# EAGLE schematic RX (EAGLE 6.4)
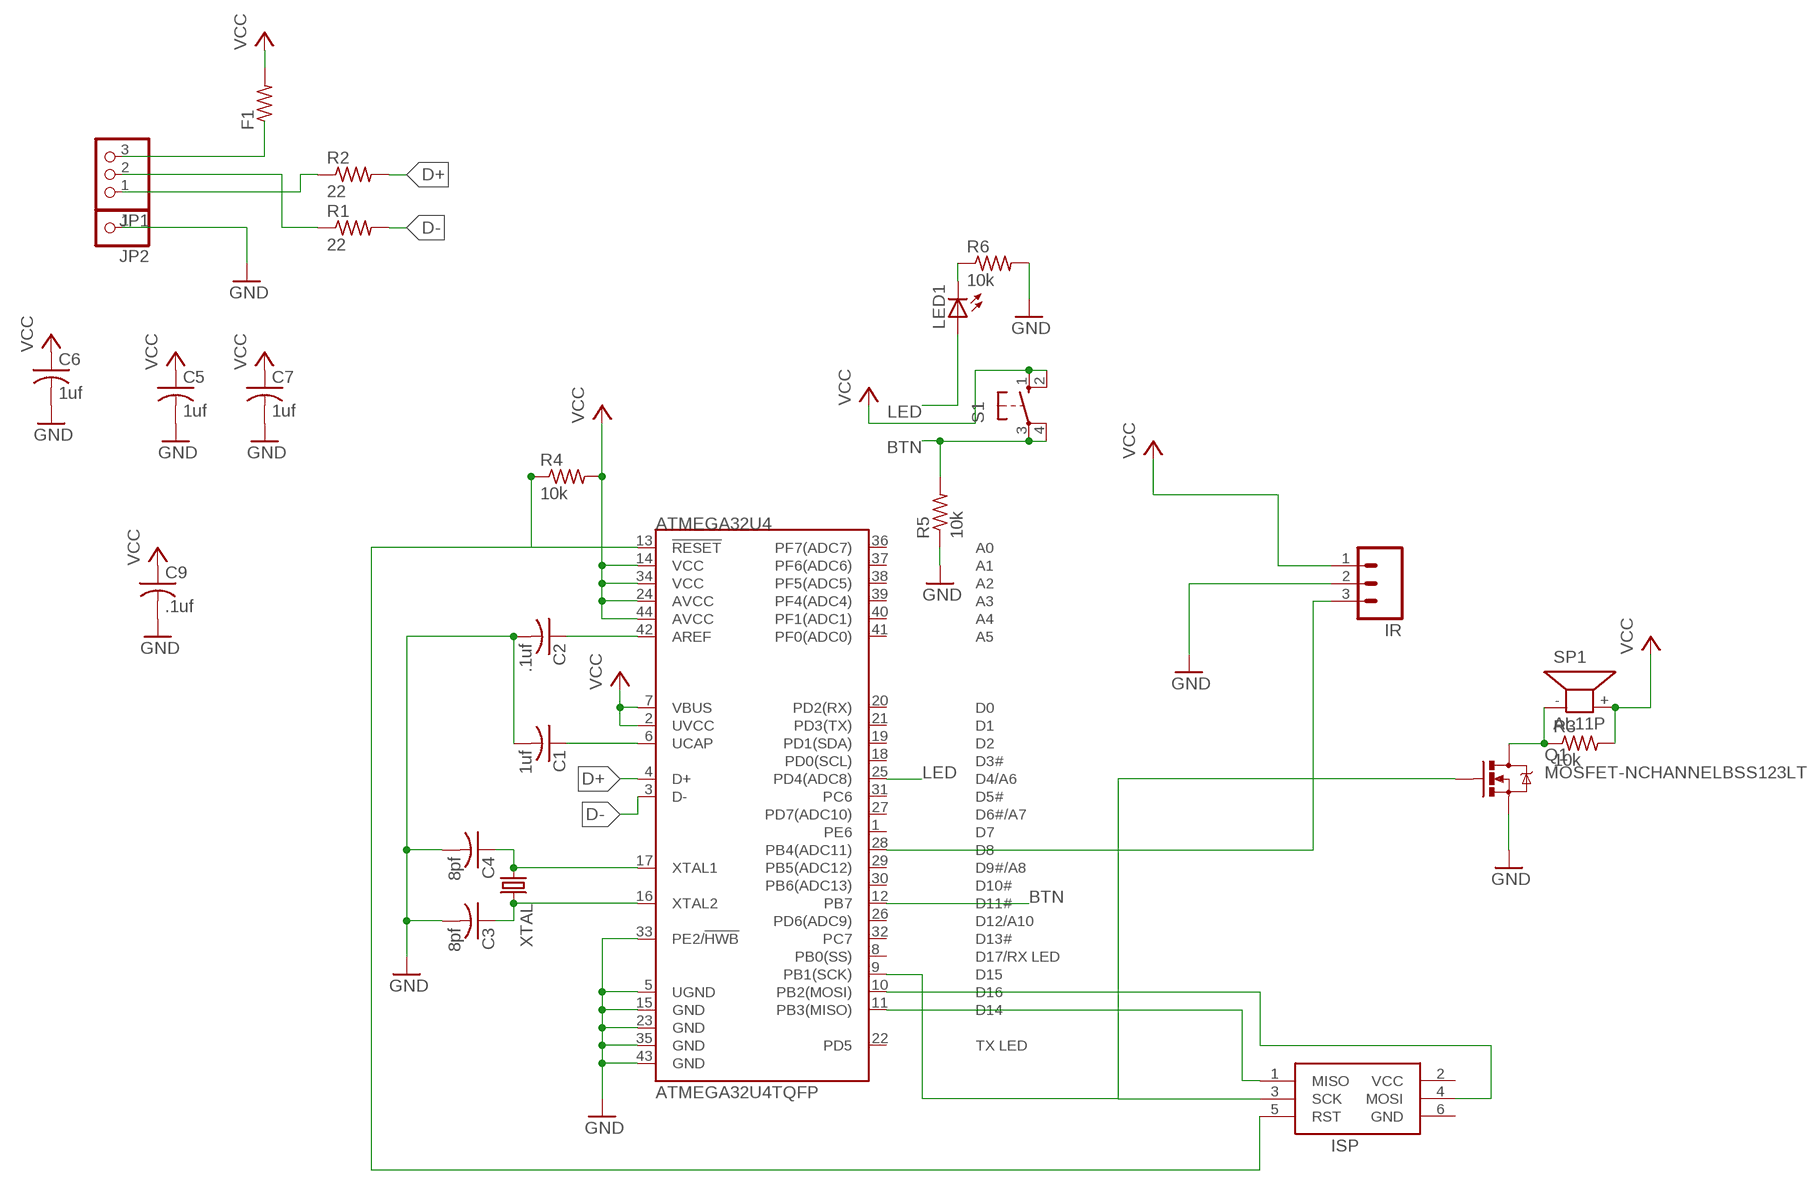
[diagram p0: schematic, sheet 1]

## Parts
ATMEGA32U4  ATMEGA32U4TQFP  [SPARKFUN-DIGITALIC_TQFP44]
C1  1uf  C-USC0805  [C0805]
C2  .1uf  C-USC0805  [C0805]
C3  8pf  C-USC0805  [C0805]
C4  8pf  C-USC0805  [C0805]
C5  1uf  C-USC0805  [C0805]
C6  1uf  C-USC0805  [C0805]
C7  1uf  C-USC0805  [C0805]
C9  .1uf  C-USC0805  [C0805]
F1  R-US_R0805  [R0805]
IR  M03PTH  [1X03]
ISP  AVRISP-6  [AVRISP]
JP1  PINHD-1X3  [1X03]
JP2  PINHD-1X1  [1X01]
LED1  LED3MM  [LED3MM]
Q1  MOSFET-NCHANNELBSS123LT1G  [SOT23]
R1  22  R-US_R0805  [R0805]
R2  22  R-US_R0805  [R0805]
R3  10k  R-US_R0805  [R0805]
R4  10k  R-US_R0805  [R0805]
R5  10k  R-US_R0805  [R0805]
R6  10k  R-US_R0805  [R0805]
S1  10-XX  [B3F-10XX]
SP1  AL11P  [AL11P]
XTAL  CRYSTAL5X3  [CRYSTAL-SMD-5X3]

## Nets
BTN: ATMEGA32U4.12(PB7) R5.2 S1.3(P) S1.4(P1)
D+: ATMEGA32U4.4(D+) R2.2
D-: ATMEGA32U4.3(D-) R1.2
GND: ATMEGA32U4.5(UGND) ATMEGA32U4.15(GND) ATMEGA32U4.23(GND) ATMEGA32U4.33(PE2/!HWB) ATMEGA32U4.35(GND) ATMEGA32U4.43(GND) C1.2 C2.2 C3.2 C4.2 C5.2 C6.2 C7.2 C9.2 IR.2 JP2.1 Q1.2(S) R5.1 R6.2
LED: ATMEGA32U4.25(PD4(ADC8)) LED1.A
N$1: F1.1 JP1.3
N$2: ATMEGA32U4.16(XTAL2) C3.1 XTAL.3
N$3: JP1.1 R2.1
N$4: JP1.2 R1.1
N$5: ATMEGA32U4.6(UCAP) C1.1
N$6: Q1.3(D) R3.1 SP1.-
N$7: ATMEGA32U4.42(AREF) C2.1
N$8: ATMEGA32U4.9(PB1(SCK)) ISP.3(SCK) Q1.1(G)
N$9: LED1.K(C) R6.1
N$10: ATMEGA32U4.17(XTAL1) C4.1 XTAL.1
N$14: ATMEGA32U4.10(PB2(MOSI)) ISP.4(MOSI)
N$32: ATMEGA32U4.11(PB3(MISO)) ISP.1(MISO)
RST: ATMEGA32U4.13(!RESET) ISP.5(RST) R4.1
RX: ATMEGA32U4.28(PB4(ADC11)) IR.3
VCC: ATMEGA32U4.2(UVCC) ATMEGA32U4.7(VBUS) ATMEGA32U4.14(VCC) ATMEGA32U4.24(AVCC) ATMEGA32U4.34(VCC) ATMEGA32U4.44(AVCC) C5.1 C6.1 C7.1 C9.1 F1.2 IR.1 R3.2 R4.2 S1.1(S) S1.2(S1) SP1.+
Unconnected: ATMEGA32U4.1(PE6) ATMEGA32U4.8(PB0(SS)) ATMEGA32U4.18(PD0(SCL)) ATMEGA32U4.19(PD1(SDA)) ATMEGA32U4.20(PD2(RX)) ATMEGA32U4.21(PD3(TX)) ATMEGA32U4.22(PD5) ATMEGA32U4.26(PD6(ADC9)) ATMEGA32U4.27(PD7(ADC10)) ATMEGA32U4.29(PB5(ADC12)) ATMEGA32U4.30(PB6(ADC13)) ATMEGA32U4.31(PC6) ATMEGA32U4.32(PC7) ATMEGA32U4.36(PF7(ADC7)) ATMEGA32U4.37(PF6(ADC6)) ATMEGA32U4.38(PF5(ADC5)) ATMEGA32U4.39(PF4(ADC4)) ATMEGA32U4.40(PF1(ADC1)) ATMEGA32U4.41(PF0(ADC0))

## Power pins joined to a net without a drawn wire
GND: ISP.6(GND)
VCC: ISP.2(VCC)

## Library data of the parts
ATMEGA32U4 = SparkFun-DigitalIC:ATMEGA32U4: Atmel 44-pin 8-bit Microcontroller with 32KBytes of ISP Flash and USB Controller ----- Please use the QFN-44-NOPAD_1:1 package for the footprint of all boards using a 32U4. Route traces directly away from the pads as much as possible.; OC_NEWARK: unknown
C1-C4 = adafruit:C-US: CAPACITOR, American symbol; MPN: C0805C105K4PACTU; OC_NEWARK: 07X0873
C5-C7 C9 = adafruit:C-US: CAPACITOR, American symbol
F1 = adafruit:R-US_: RESISTOR, American symbol
IR = SparkFun-Connectors:M03: Header 3 Standard 3-pin 0.1" header. Use with straight break away headers (SKU : PRT-00116), right angle break away headers (PRT-00553), swiss pins (PRT-00743), machine pins (PRT-00117), and female headers (PRT-00115). Molex polarized connector foot print use with SKU : PRT-08232 with associated crimp pins and housings.
ISP = adafruit:AVRISP: AVR ISP HEADER Standard 6 pin header for AVR programming
JP1 = adafruit:PINHD-1X3: PIN HEADER
JP2 = adafruit:PINHD-1X1: Pin header 1x1 for 0.1" spacing With round pins
LED1 = SparkFun-LED:LED: LEDs Standard schematic elements and footprints for 5mm, 3mm, 1206, and 0603 sized LEDs. 5mm - Spark Fun Electronics SKU : COM-00529 (and others)
Q1 = SparkFun-DiscreteSemi:MOSFET-NCHANNEL: Common NMOSFET Parts MFG P/N Store ID Prod ID FDD8780 TRANS-09984 SI7820DN TRANS-11055 FDS6630A IC-08089 2N7002PW TRANS-11151 FQP30N06L COM-10213 TRANS-10060 BSS123LT1G TRANS-08345 BSS138 TRANS-00830 BS170 2N7000; PROD_ID: TRANS-08345
R1-R6 = resistor:R-US_: RESISTOR, American symbol; OC_NEWARK: unknown
S1 = switch-omron:10-XX: OMRON SWITCH; MPN: B3F-1000; OC_FARNELL: 176432; OC_NEWARK: 36M3542
SP1 = buzzer:AL11P: SPEAKER Source: Buerklin; OC_FARNELL: unknown; OC_NEWARK: unknown
XTAL = SparkFun-FreqCtrl:CRYSTAL: Various standard crystals. Proven footprints. Spark Fun Electronics SKU : COM-00534; OC_NEWARK: unknown

## Net classes
0 default: width 0.203 mm, drill 0.508 mm, clearance 0.254 mm